# Altium schematic sheet WIFI.SchDoc
size A4; SheetNumber: 5; SheetTotal: 9
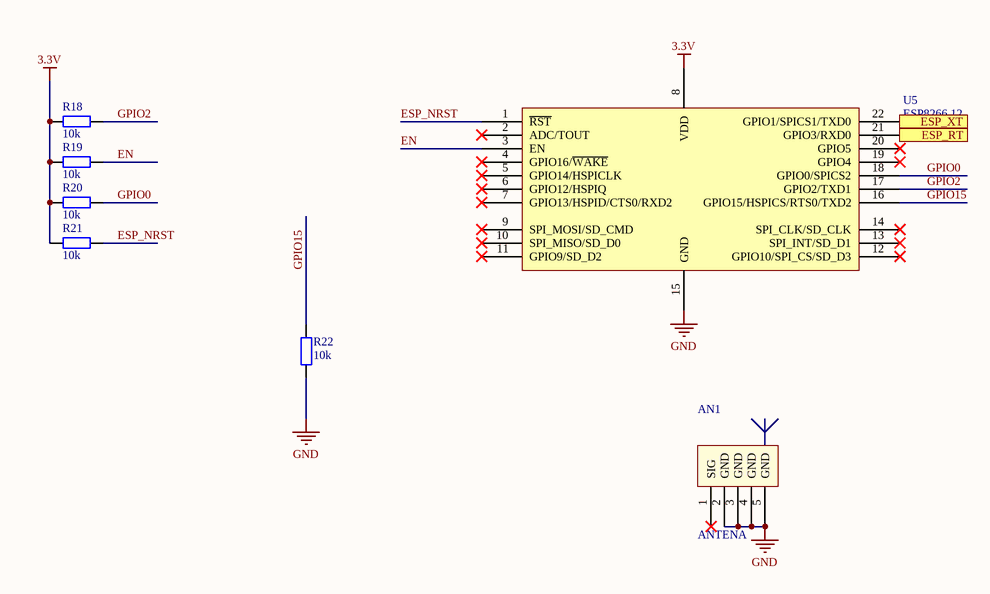
[diagram p0: WIFI.SchDoc]

## Parts
AN1  ANTENA  [DE ANTEN SMA CONG]
R18  10k  [tro smd 0603]
R19  10k  [tro smd 0603]
R20  10k  [tro smd 0603]
R21  10k  [tro smd 0603]
R22  10k  [tro smd 0603]
U5  ESP8266 12  [ESP8266 12]

## Ports
ESP_RT (in), ESP_XT (out)

## Nets
3.3V: R18.1 R19.1 R20.1 R21.1 U5.8(VDD)
GND: AN1.2(GND) AN1.3(GND) AN1.4(GND) AN1.5(GND) R22.1 U5.15(GND)
EN: R19.2 U5.3(EN)
ESP_NRST: R21.2 U5.1(~{RST})
ESP_RT: U5.21(GPIO3/RXD0) ; port ESP_RT
ESP_XT: U5.22(GPIO1/SPICS1/TXD0) ; port ESP_XT
GPIO0: R20.2 U5.18(GPIO0/SPICS2)
GPIO2: R18.2 U5.17(GPIO2/TXD1)
GPIO15: R22.2 U5.16(GPIO15/HSPICS/RTS0/TXD2)

Not connected (* = marked no-connect by the designer): AN1 1(SIG)*; U5 2(ADC/TOUT)* 4(GPIO16/~{WAKE})* 5(GPIO14/HSPICLK)* 6(GPIO12/HSPIQ)* 7(GPIO13/HSPID/CTS0/RXD2)* 9(SPI_MOSI/SD_CMD)* 10(SPI_MISO/SD_D0)* 11(GPIO9/SD_D2)* 12(GPIO10/SPI_CS/SD_D3)* 13(SPI_INT/SD_D1)* 14(SPI_CLK/SD_CLK)* 19(GPIO4)* 20(GPIO5)*

## Library data of the parts
AN1 = ANTEN SMA CONG: Generic Antenna
R18-R22 = Tro 0603 5% 10k: Dán; Don_Vi: Con; So_Chan: 2; Ten_Linh_Kien: Trở 0603 5% 10k; Ma_Hang: MH006316; Chung_Loai: Dán; Kieu_Chan: *
U5 = ESP8266 12: ESP8266 12 22 Pin; IC: ESP8266-EX; Vendor: Ai-thinker